# EAGLE schematic TP-34ren (EAGLE 6.6.0)

## Sheet 1 of 4
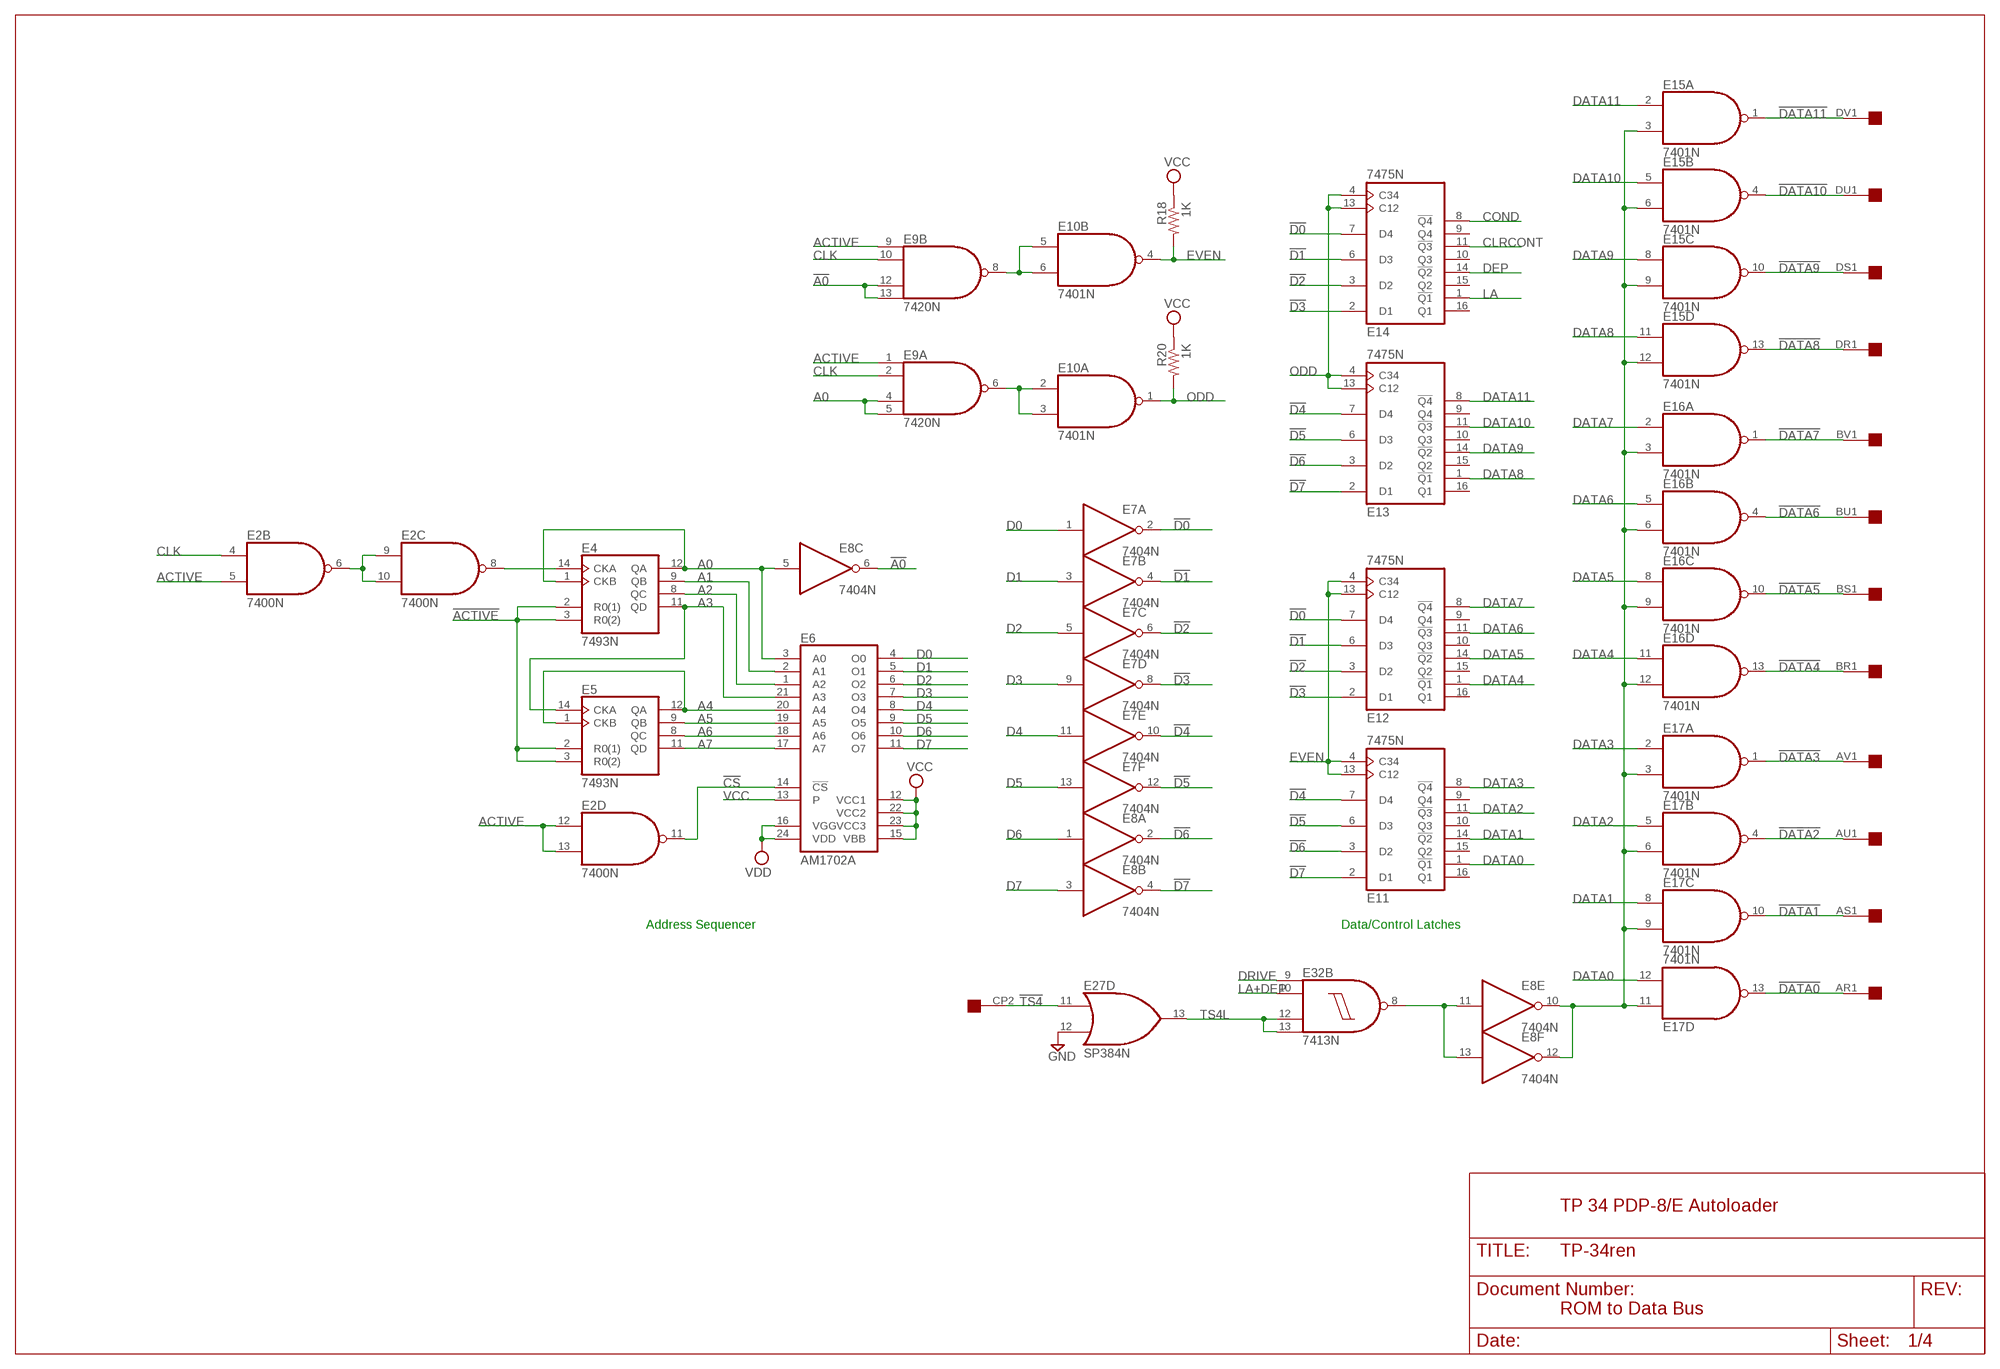
[diagram p0: schematic, sheet 1]

### Parts
E2  7400N  [DIL14]
E4  7493N  74LS93N  [DIL14]
E5  7493N  74LS93N  [DIL14]
E6  AM1702A  AM1702  [DIL24]
E7  7404N  [DIL14]
E8  7404N  [DIL14]
E9  7420N  74S20N  [DIL14]
E10  7401N  74LS01N  [DIL14]
E11  7475N  [DIL16]
E12  7475N  [DIL16]
E13  7475N  [DIL16]
E14  7475N  [DIL16]
E15  7401N  74LS01N  [DIL14]
E16  7401N  74LS01N  [DIL14]
E17  7401N  74LS01N  [DIL14]
E27  SP384N  [DIL14]
E32  7413N  [DIL14]
R18  1K  R-US_0207/10  [0207/10]
R20  1K  R-US_0207/10  [0207/10]
U$2  QUAD  [EDGE-CON8]

### Nets
!A0: E8.6(C:O) E9.12(B:I2) E9.13(B:I3)
!ACTIVE: E4.2(R0(1)) E4.3(R0(2)) E5.2(R0(1)) E5.3(R0(2)) ; also sheet 2
!CS: E2.11(D:O) E6.14(!CS)
!D0: E7.2(A:O) E12.7(D4) E14.7(D4)
!D1: E7.4(B:O) E12.6(D3) E14.6(D3)
!D2: E7.6(C:O) E12.3(D2) E14.3(D2)
!D3: E7.8(D:O) E12.2(D1) E14.2(D1)
!D4: E7.10(E:O) E11.7(D4) E13.7(D4)
!D5: E7.12(F:O) E11.6(D3) E13.6(D3)
!D6: E8.2(A:O) E11.3(D2) E13.3(D2)
!D7: E8.4(B:O) E11.2(D1) E13.2(D1)
!DATA0: E17.13(D:O) U$2.AR1
!DATA1: E17.10(C:O) U$2.AS1
!DATA2: E17.4(B:O) U$2.AU1
!DATA3: E17.1(A:O) U$2.AV1
!DATA4: E16.13(D:O) U$2.BR1
!DATA5: E16.10(C:O) U$2.BS1
!DATA6: E16.4(B:O) U$2.BU1
!DATA7: E16.1(A:O) U$2.BV1
!DATA8: E15.13(D:O) U$2.DR1
!DATA9: E15.10(C:O) U$2.DS1
!DATA10: E15.4(B:O) U$2.DU1
!DATA11: E15.1(A:O) U$2.DV1
!TS4: E27.11(D:I0) U$2.CP2
A0: E4.1(CKB) E4.12(QA) E6.3(A0) E8.5(C:I) E9.4(A:I2) E9.5(A:I3)
A1: E4.9(QB) E6.2(A1)
A2: E4.8(QC) E6.1(A2)
A3: E4.11(QD) E5.14(CKA) E6.21(A3)
A4: E5.1(CKB) E5.12(QA) E6.20(A4)
A5: E5.9(QB) E6.19(A5)
A6: E5.8(QC) E6.18(A6)
A7: E5.11(QD) E6.17(A7)
ACTIVE: E2.5(B:I1) E2.12(D:I0) E2.13(D:I1) E9.1(A:I0) E9.9(B:I0) ; also sheet 2
CLK: E2.4(B:I0) E9.2(A:I1) E9.10(B:I1) ; also sheet 2
CLRCONT: E14.11(!Q3) ; also sheet 2
COND: E14.8(!Q4) ; also sheet 2
D0: E6.4(O0) E7.1(A:I)
D1: E6.5(O1) E7.3(B:I)
D2: E6.6(O2) E7.5(C:I)
D3: E6.7(O3) E7.9(D:I)
D4: E6.8(O4) E7.11(E:I)
D5: E6.9(O5) E7.13(F:I)
D6: E6.10(O6) E8.1(A:I)
D7: E6.11(O7) E8.3(B:I)
DATA0: E11.1(!Q1) E17.12(D:I1)
DATA1: E11.14(!Q2) E17.8(C:I0)
DATA2: E11.11(!Q3) E17.5(B:I0)
DATA3: E11.8(!Q4) E17.2(A:I0)
DATA4: E12.1(!Q1) E16.11(D:I0)
DATA5: E12.14(!Q2) E16.8(C:I0)
DATA6: E12.11(!Q3) E16.5(B:I0)
DATA7: E12.8(!Q4) E16.2(A:I0)
DATA8: E13.1(!Q1) E15.11(D:I0)
DATA9: E13.14(!Q2) E15.8(C:I0)
DATA10: E13.11(!Q3) E15.5(B:I0)
DATA11: E13.8(!Q4) E15.2(A:I0)
DEP: E14.14(!Q2) ; also sheet 2
DRIVE: E32.9(B:I0) ; also sheet 3
EVEN: E10.4(B:O) E11.4(C34) E11.13(C12) E12.4(C34) E12.13(C12) R18.2
GND [supply]: E27.12(D:I1) ; also sheet 2,3
LA: E14.1(!Q1) ; also sheet 2
LA+DEP: E32.10(B:I1) ; also sheet 3
N$7: E9.6(A:O) E10.2(A:I0) E10.3(A:I1)
N$9: E9.8(B:O) E10.5(B:I0) E10.6(B:I1)
N$20: E8.10(E:O) E8.12(F:O) E15.3(A:I1) E15.6(B:I1) E15.9(C:I1) E15.12(D:I1) E16.3(A:I1) E16.6(B:I1) E16.9(C:I1) E16.12(D:I1) E17.3(A:I1) E17.6(B:I1) E17.9(C:I1) E17.11(D:I0)
N$99: E8.11(E:I) E8.13(F:I) E32.8(B:O)
N$163: E2.6(B:O) E2.9(C:I0) E2.10(C:I1)
N$167: E2.8(C:O) E4.14(CKA)
ODD: E10.1(A:O) E13.4(C34) E13.13(C12) E14.4(C34) E14.13(C12) R20.2 ; also sheet 2
TS4L: E27.13(D:O) E32.12(B:I2) E32.13(B:I3)
VCC [supply]: E6.12(VCC1) E6.13(P) E6.15(VBB) E6.22(VCC2) E6.23(VCC3) R18.1 R20.1 ; also sheet 2,3
VDD: E6.16(VGG) E6.24(VDD) ; also sheet 2
Unconnected: E11.9(Q4) E11.10(Q3) E11.15(Q2) E11.16(Q1) E12.9(Q4) E12.10(Q3) E12.15(Q2) E12.16(Q1) E13.9(Q4) E13.10(Q3) E13.15(Q2) E13.16(Q1) E14.9(Q4) E14.10(Q3) E14.15(Q2) E14.16(Q1) E27.9(C:I0) E27.10(C:I1) E27.14(C:O) U$2.AA1 U$2.AB1 U$2.AC1 U$2.AD1 U$2.AD2 U$2.AE1 U$2.AE2 U$2.AH1 U$2.AH2 U$2.AJ1 U$2.AK1 U$2.AL1 U$2.AL2 U$2.AM1 U$2.AM2 U$2.AN2 U$2.AP1 U$2.AP2 U$2.AR2 U$2.AS2 U$2.AT1 U$2.AT2 U$2.AU2 U$2.AV2 U$2.BA1 U$2.BB1 U$2.BB2 U$2.BC1 U$2.BD1 U$2.BD2 U$2.BE1 U$2.BE2 U$2.BH1 U$2.BH2 U$2.BJ1 U$2.BJ2 U$2.BK1 U$2.BL1 U$2.BL2 U$2.BM1 U$2.BN2 U$2.BP1 U$2.BP2 U$2.BR2 U$2.BS2 U$2.BT1 U$2.BT2 U$2.BV2 U$2.CA1 U$2.CB1 U$2.CB2 U$2.CC1 U$2.CD1 U$2.CD2 U$2.CE1 U$2.CE2 U$2.CF1 U$2.CH1 U$2.CH2 U$2.CJ1 U$2.CK1 U$2.CK2 U$2.CL1 U$2.CL2 U$2.CM1 U$2.CM2 U$2.CN1 U$2.CN2 U$2.CP1 U$2.CR2 U$2.CS1 U$2.CS2 U$2.CT1 U$2.CU1 U$2.CU2 U$2.CV2 U$2.DA1 U$2.DA2 U$2.DB1 U$2.DC1 U$2.DC2 U$2.DD1 U$2.DD2 U$2.DE1 U$2.DE2 U$2.DH1 U$2.DH2 U$2.DJ1 U$2.DJ2 U$2.DK1 U$2.DK2 U$2.DL1 U$2.DL2 U$2.DM1 U$2.DM2 U$2.DP1 U$2.DP2 U$2.DT1 U$2.DT2

### Notes on the sheet
- Address Sequencer | Data/Control Latches
- TP 34 PDP-8/E Autoloader
- ROM to Data Bus

## Sheet 2 of 4
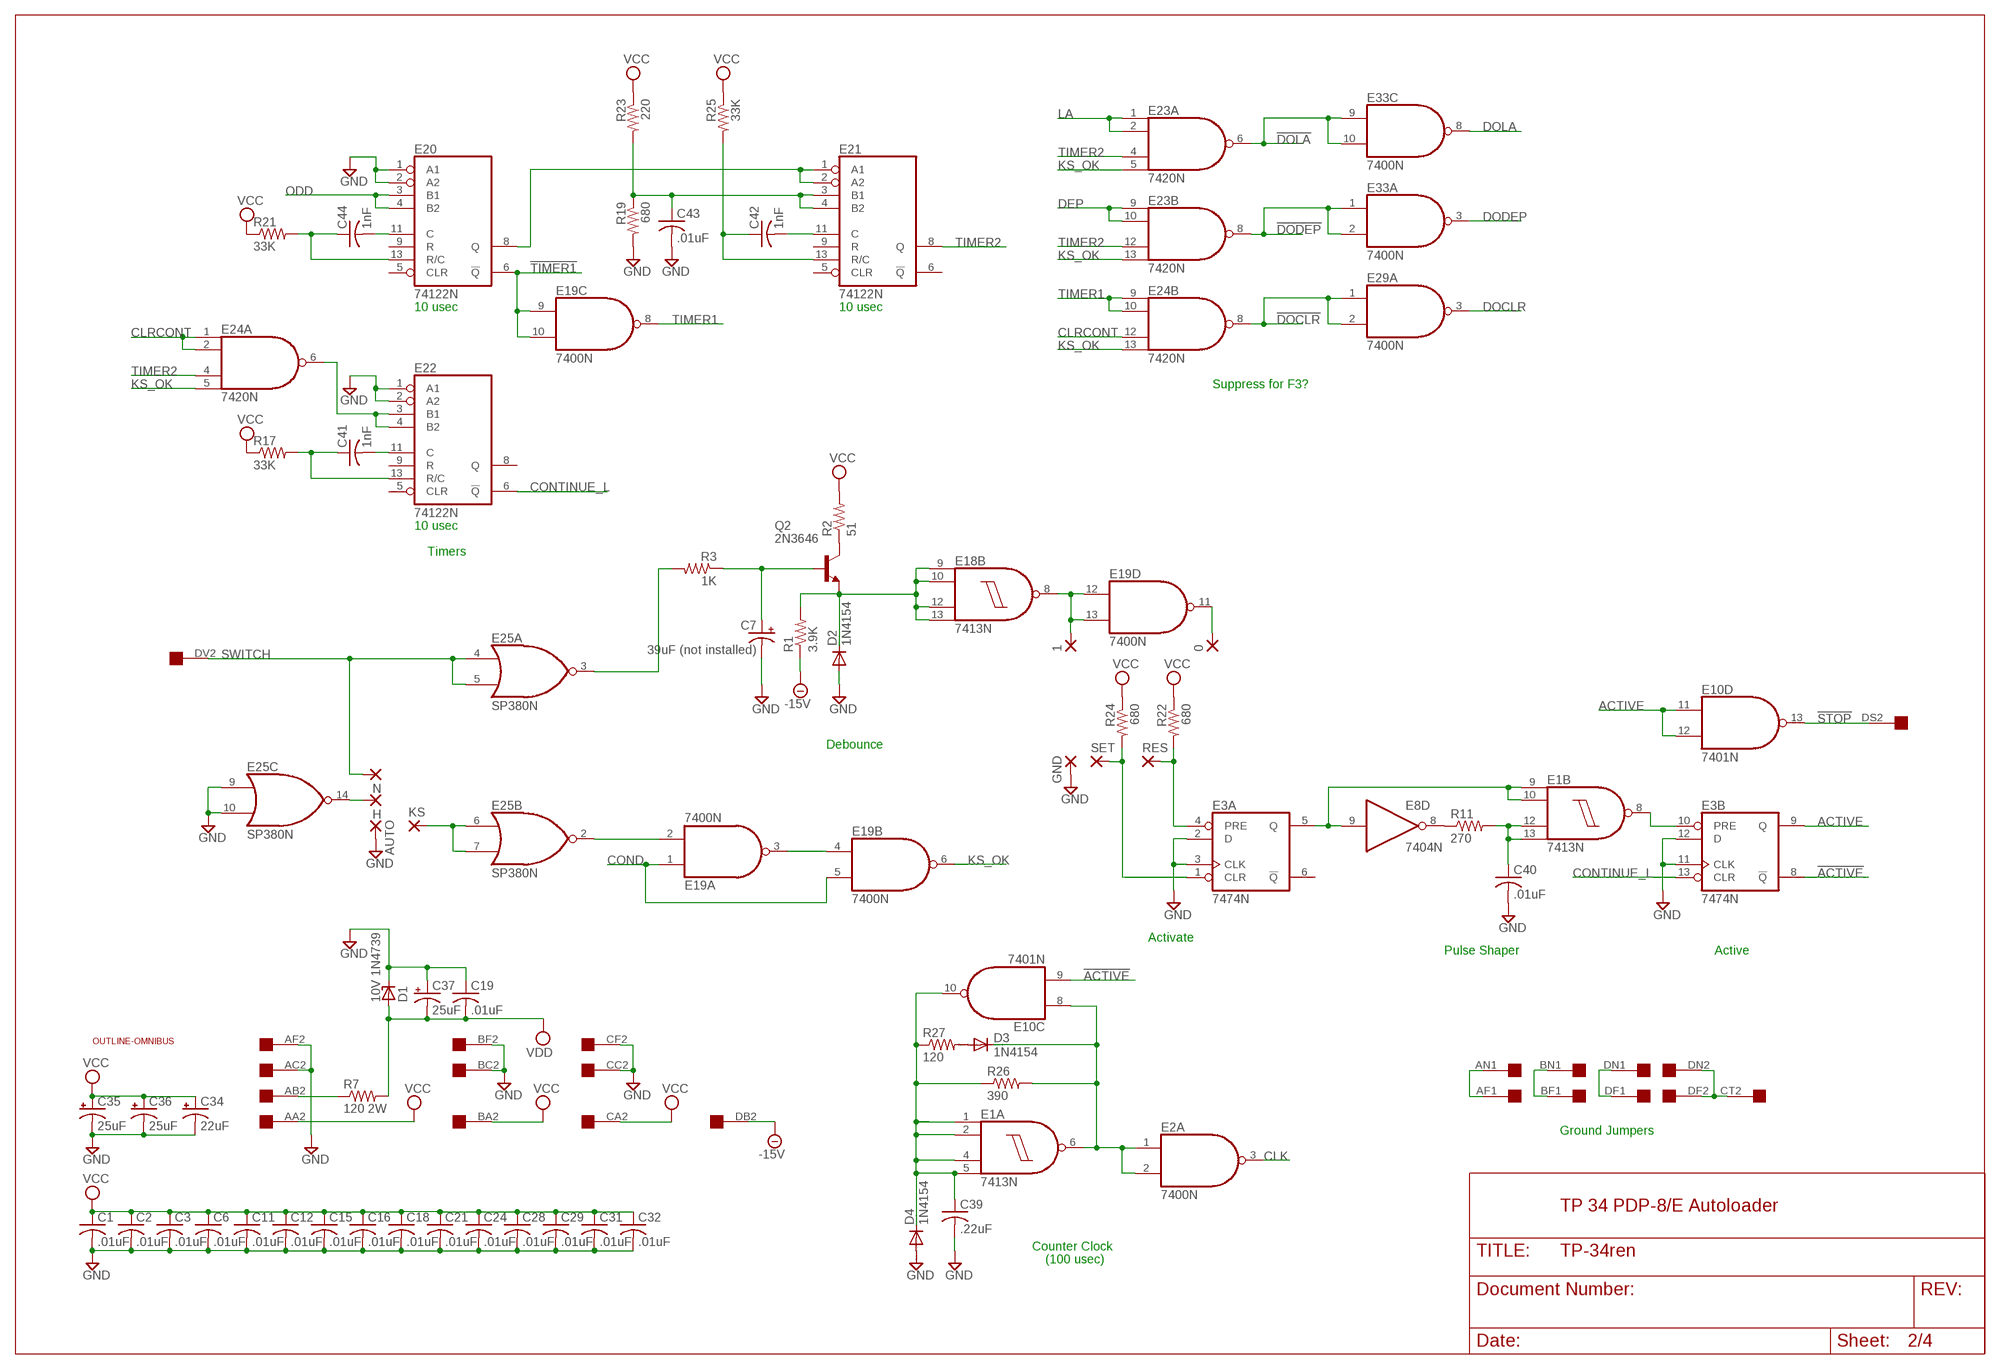
[diagram p1: schematic, sheet 2]

### Parts
0  1,6/0,8  [1,6/0,8]
1  1,6/0,8  [1,6/0,8]
AUTO  1,6/0,8  [1,6/0,8]
C1  .01uF  C-US075-032X103  [C075-032X103]
C2  .01uF  C-US075-032X103  [C075-032X103]
C3  .01uF  C-US075-032X103  [C075-032X103]
C6  .01uF  C-US075-032X103  [C075-032X103]
C7  39uF (not installed)  CPOL-USE15-5AXIAL  [E15-5]
C11  .01uF  C-US075-032X103  [C075-032X103]
C12  .01uF  C-US075-032X103  [C075-032X103]
C15  .01uF  C-US075-032X103  [C075-032X103]
C16  .01uF  C-US075-032X103  [C075-032X103]
C18  .01uF  C-US075-032X103  [C075-032X103]
C19  .01uF  C-US075-032X103  [C075-032X103]
C21  .01uF  C-US075-032X103  [C075-032X103]
C24  .01uF  C-US075-032X103  [C075-032X103]
C28  .01uF  C-US075-032X103  [C075-032X103]
C29  .01uF  C-US075-032X103  [C075-032X103]
C31  .01uF  C-US075-032X103  [C075-032X103]
C32  .01uF  C-US075-032X103  [C075-032X103]
C34  22uF  CPOL-USE20-8AXIAL  [E12-8]
C35  25uF  CPOL-USE15-5AXIAL  [E15-5]
C36  25uF  CPOL-USE15-5AXIAL  [E15-5]
C37  25uF  CPOL-USE15-5AXIAL  [E15-5]
C39  .22uF  C-US075-032X103  [C075-032X103]
C40  .01uF  C-US075-032X103  [C075-032X103]
C41  1nF  C-US075-032X103  [C075-032X103]
C42  1nF  C-US075-032X103  [C075-032X103]
C43  .01uF  C-US075-032X103  [C075-032X103]
C44  1nF  C-US075-032X103  [C075-032X103]
D1  10V 1N4739  ZENER-DIODEC1702-15  [C1702-15]
D2  1N4154  1N4148DO35-10  [DO35-10]
D3  1N4154  1N4148DO35-10  [DO35-10]
D4  1N4154  1N4148DO35-10  [DO35-10]
E1  7413N  [DIL14]
E3  7474N  74S74N  [DIL14]
E18  7413N  [DIL14]
E19  7400N  [DIL14]
E20  74122N  74LS122N  [DIL14]
E21  74122N  74LS122N  [DIL14]
E22  74122N  74LS122N  [DIL14]
E23  7420N  74S20N  [DIL14]
E24  7420N  74S20N  [DIL14]
E25  SP380N  [DIL14]
E29  7400N  [DIL14]
E33  7400N  [DIL14]
GND  1,6/0,8  [1,6/0,8]
H  1,6/0,8  [1,6/0,8]
KS  1,6/0,8  [1,6/0,8]
N  1,6/0,8  [1,6/0,8]
Q2  2N3646  2N2102  [TO5]
R1  3.9K  R-US_0207/10  [0207/10]
R2  51  R-US_0207/10  [0207/10]
R3  1K  R-US_0207/10  [0207/10]
R7  120 2W  R-US_0414/15  [0414/15]
R11  270  R-US_0207/12  [0207/12]
R17  33K  R-US_0207/10  [0207/10]
R19  680  R-US_0207/10  [0207/10]
R21  33K  R-US_0207/10  [0207/10]
R22  680  R-US_0207/10  [0207/10]
R23  220  R-US_0207/10  [0207/10]
R24  680  R-US_0207/10  [0207/10]
R25  33K  R-US_0207/10  [0207/10]
R26  390  R-US_0207/10  [0207/10]
R27  120  R-US_0207/10  [0207/10]
RES  1,6/0,8  [1,6/0,8]
SET  1,6/0,8  [1,6/0,8]
U$1  OUTLINE-OMNIBUS  [OMNIBUS]

### Nets
!ACTIVE: E3.8(B:!Q) E10.9(C:I1) ; also sheet 1
!DOCLR: E24.8(B:O) E29.1(A:I0) E29.2(A:I1) ; also sheet 3
!DODEP: E23.8(B:O) E33.1(A:I0) E33.2(A:I1) ; also sheet 3
!DOLA: E23.6(A:O) E33.9(C:I0) E33.10(C:I1) ; also sheet 3
!STOP: E10.13(D:O) U$2.DS2
!TIMER1: E19.9(C:I0) E19.10(C:I1) E20.6(!Q)
-15V: R1.1 U$2.DB2
ACTIVE: E3.9(B:Q) E10.11(D:I0) E10.12(D:I1) ; also sheet 1
CLK: E2.3(A:O) ; also sheet 1
CLRCONT: E24.1(A:I0) E24.2(A:I1) E24.12(B:I2) ; also sheet 1
COND: E19.1(A:I0) E19.5(B:I1) ; also sheet 1
CONTINUE_L: E3.13(B:CLR) E22.6(!Q) ; also sheet 3
DEP: E23.9(B:I0) E23.10(B:I1) ; also sheet 1
DOCLR: E29.3(A:O) ; also sheet 3
DODEP: E33.3(A:O) ; also sheet 3
DOLA: E33.8(C:O) ; also sheet 3
GND [supply]: AUTO.1(P) C1.2 C2.2 C3.2 C6.2 C7.- C11.2 C12.2 C15.2 C16.2 C18.2 C19.1 C21.2 C24.2 C28.2 C29.2 C31.2 C32.2 C34.- C35.- C36.- C37.+ C39.2 C40.2 C43.2 D1.C D2.A D4.A E3.2(A:D) E3.3(A:CLK) E3.11(B:CLK) E3.12(B:D) E20.1(A1) E20.2(A2) E22.1(A1) E22.2(A2) E25.9(C:I0) E25.10(C:I1) GND.1(P) R19.2 U$2.AC2 U$2.AF2 U$2.BC2 U$2.BF2 U$2.CC2 U$2.CF2 ; also sheet 1,3
KS_OK: E19.6(B:O) E23.5(A:I3) E23.13(B:I3) E24.5(A:I3) E24.13(B:I3)
LA: E23.1(A:I0) E23.2(A:I1) ; also sheet 1
N$1 [supply]: U$2.AF1 U$2.AN1
N$2 [supply]: U$2.BF1 U$2.BN1
N$3 [supply]: U$2.DF1 U$2.DN1
N$4 [supply]: U$2.CT2 U$2.DF2 U$2.DN2
N$6: D2.C E18.9(B:I0) E18.10(B:I1) E18.12(B:I2) E18.13(B:I3) Q2.1(E) R1.2
N$11: D3.C E1.6(A:O) E2.1(A:I0) E2.2(A:I1) E10.8(C:I0) R26.2
N$17: D3.A R27.2
N$21: C39.1 D4.C E1.1(A:I0) E1.2(A:I1) E1.4(A:I2) E1.5(A:I3) E10.10(C:O) R26.1 R27.1
N$26: E1.9(B:I0) E1.10(B:I1) E3.5(A:Q) E8.9(D:I)
N$44: 1.1(P) E18.8(B:O) E19.12(D:I0) E19.13(D:I1)
N$49: E3.4(A:PRE) R22.2 RES.1(P)
N$50: E3.1(A:CLR) R24.2 SET.1(P)
N$57: 0.1(P) E19.11(D:O)
N$64: C42.1 E21.13(R/C) R25.2
N$65: C42.2 E21.11(C)
N$67: C43.1 E21.3(B1) E21.4(B2) R19.1 R23.2
N$74: C44.1 E20.13(R/C) R21.2
N$75: C40.1 E1.12(B:I2) E1.13(B:I3) R11.2
N$84: E1.8(B:O) E3.10(B:PRE)
N$85: C44.2 E20.11(C)
N$107: E8.8(D:O) R11.1
N$159: C7.+ Q2.2(B) R3.1
N$173: Q2.3(C) R2.1
N$223: C41.1 E22.13(R/C) R17.2
N$234: C41.2 E22.11(C)
N$240 [supply]: R7.1 U$2.AB2
N$300: E19.3(A:O) E19.4(B:I0)
N$302: E19.2(A:I1) E25.2(B:O)
N$315: E22.3(B1) E22.4(B2) E24.6(A:O)
N$325: E25.6(B:I0) E25.7(B:I1) KS.1(P)
N$331: E25.14(C:O) H.1(P)
N$344: E20.8(Q) E21.1(A1) E21.2(A2)
ODD: E20.3(B1) E20.4(B2) ; also sheet 1
SWITCH: E25.4(A:I0) E25.5(A:I1) N.1(P) U$2.DV2
SWITCHL: E25.3(A:O) R3.2
TIMER1: E19.8(C:O) E24.9(B:I0) E24.10(B:I1)
TIMER2: E21.8(Q) E23.4(A:I2) E23.12(B:I2) E24.4(A:I2)
VCC [supply]: C1.1 C2.1 C3.1 C6.1 C11.1 C12.1 C15.1 C16.1 C18.1 C21.1 C24.1 C28.1 C29.1 C31.1 C32.1 C34.+ C35.+ C36.+ R2.2 R17.1 R21.1 R22.1 R23.1 R24.1 R25.1 U$2.AA2 U$2.BA2 U$2.CA2 ; also sheet 1,3
VDD: C19.2 C37.- D1.A R7.2 ; also sheet 1
Unconnected: E3.6(A:!Q) E20.5(CLR) E20.9(R) E21.5(CLR) E21.6(!Q) E21.9(R) E22.5(CLR) E22.8(Q) E22.9(R) E25.11(D:I0) E25.12(D:I1) E25.13(D:O) E33.11(D:O) E33.12(D:I0) E33.13(D:I1)

### Notes on the sheet
- 10 usec | 10 usec
- Suppress for F3?
- 10 usec
- Timers
- Debounce
- Activate
- Pulse Shaper | Active
- Ground Jumpers
- TP 34 PDP-8/E Autoloader
- Counter Clock
- (100 usec)

## Sheet 3 of 4
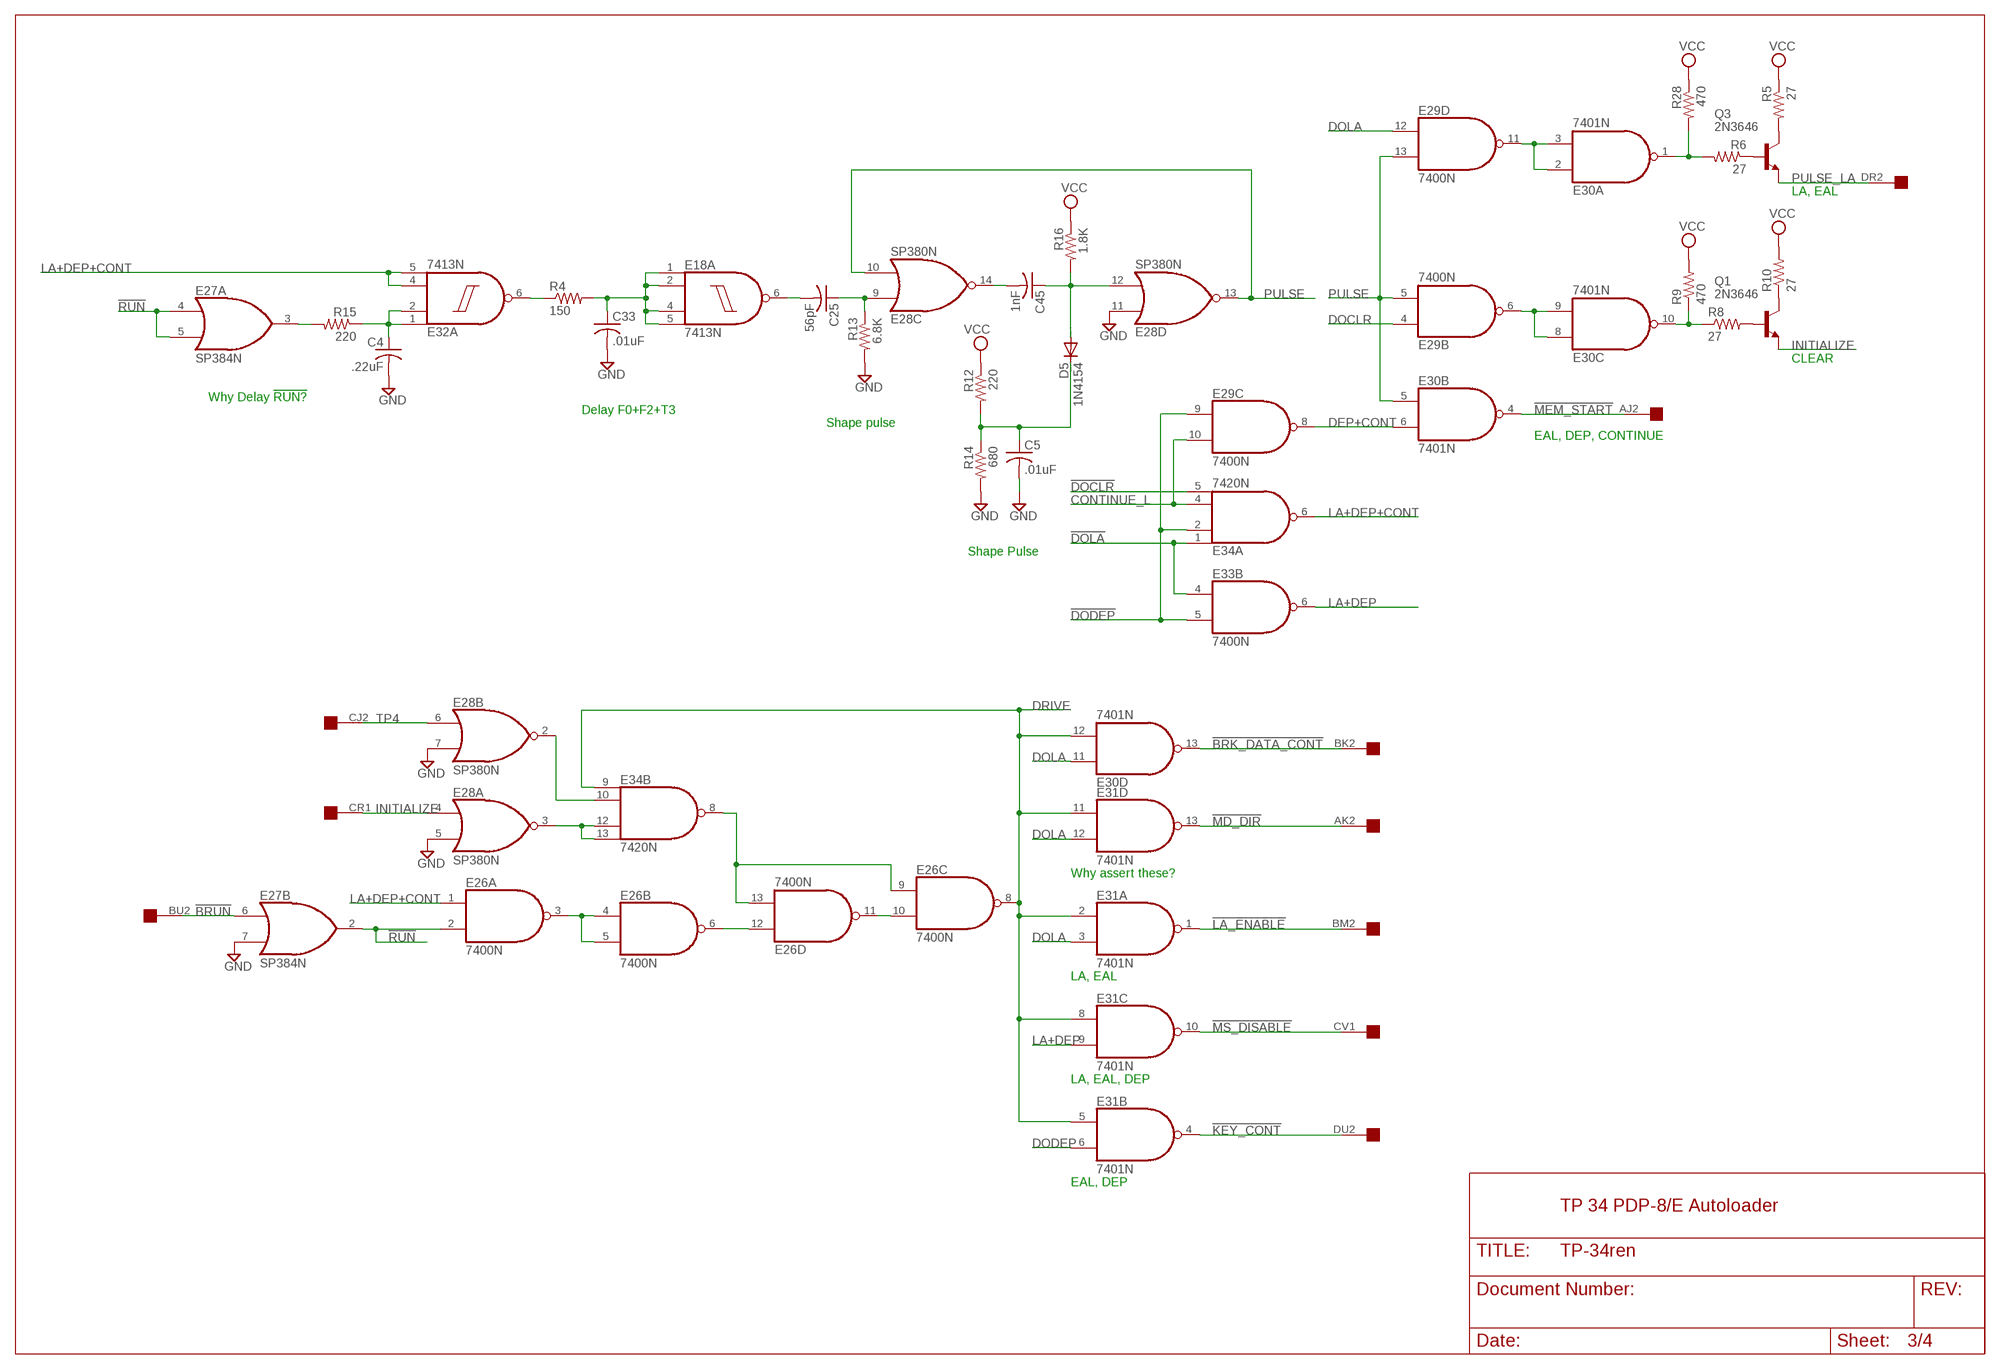
[diagram p2: schematic, sheet 3]

### Parts
C4  .22uF  C-US075-032X103  [C075-032X103]
C5  .01uF  C-US075-032X103  [C075-032X103]
C25  56pF  C-US102-043X133  [C102-043X133]
C33  .01uF  C-US075-032X103  [C075-032X103]
C45  1nF  C-US050-035X075  [C050-035X075]
D5  1N4154  1N4148DO35-10  [DO35-10]
E26  7400N  [DIL14]
E28  SP380N  [DIL14]
E30  7401N  74LS01N  [DIL14]
E31  7401N  74LS01N  [DIL14]
E34  7420N  74S20N  [DIL14]
Q1  2N3646  2N2102  [TO5]
Q3  2N3646  2N2102  [TO5]
R4  150  R-US_0207/10  [0207/10]
R5  27  R-US_0207/10  [0207/10]
R6  27  R-US_0207/10  [0207/10]
R8  27  R-US_0207/10  [0207/10]
R9  470  R-US_0207/10  [0207/10]
R10  27  R-US_0207/10  [0207/10]
R12  220  R-US_0207/10  [0207/10]
R13  6.8K  R-US_0207/10  [0207/10]
R14  680  R-US_0207/10  [0207/10]
R15  220  R-US_0207/15  [0207/15]
R16  1.8K  R-US_0207/10  [0207/10]
R28  470  R-US_0207/10  [0207/10]

### Nets
!BRK_DATA_CONT: E30.13(D:O) U$2.BK2
!BRUN: E27.6(B:I0) U$2.BU2
!DOCLR: E34.5(A:I3) ; also sheet 2
!DODEP: E29.9(C:I0) E33.5(B:I1) E34.2(A:I1) ; also sheet 2
!DOLA: E33.4(B:I0) E34.1(A:I0) ; also sheet 2
!INITIALIZE: E28.3(A:O) E34.12(B:I2) E34.13(B:I3)
!KEY_CONT: E31.4(B:O) U$2.DU2
!LA_ENABLE: E31.1(A:O) U$2.BM2
!MD_DIR: E31.13(D:O) U$2.AK2
!MEM_START: E30.4(B:O) U$2.AJ2
!MS_DISABLE: E31.10(C:O) U$2.CV1
!RUN: E26.2(A:I1) E27.2(B:O) E27.4(A:I0) E27.5(A:I1)
!TP4: E28.2(B:O) E34.10(B:I1)
BRUNL: E27.3(A:O) R15.2
CONTINUE_L: E29.10(C:I1) E34.4(A:I2) ; also sheet 2
DEP+CONT: E29.8(C:O) E30.6(B:I1)
DOCLR: E29.4(B:I0) ; also sheet 2
DODEP: E31.6(B:I1) ; also sheet 2
DOLA: E29.12(D:I0) E30.11(D:I0) E31.3(A:I1) E31.12(D:I1) ; also sheet 2
DRIVE: E26.8(C:O) E30.12(D:I1) E31.2(A:I0) E31.5(B:I0) E31.8(C:I0) E31.11(D:I0) E34.9(B:I0) ; also sheet 1
GND [supply]: C4.2 C5.2 C33.2 E27.7(B:I1) E28.5(A:I1) E28.7(B:I1) E28.11(D:I0) R13.2 R14.2 ; also sheet 1,2
INITIALIZE: E28.4(A:I0) Q1.1(E) U$2.CR1
LA+DEP: E31.9(C:I1) E33.6(B:O) ; also sheet 1
LA+DEP+CONT: E26.1(A:I0) E32.4(A:I2) E32.5(A:I3) E34.6(A:O)
N$5: E26.6(B:O) E26.12(D:I0)
N$14: C25.2 E18.6(A:O)
N$22: C25.1 E28.9(C:I0) R13.1
N$23: C45.1 D5.A E28.12(D:I1) R16.2
N$24: C5.1 D5.C R12.2 R14.1
N$28: C45.2 E28.14(C:O)
N$38: E26.9(C:I0) E26.13(D:I1) E34.8(B:O)
N$94: E29.11(D:O) E30.2(A:I0) E30.3(A:I1)
N$96: E29.6(B:O) E30.8(C:I0) E30.9(C:I1)
N$110: E26.3(A:O) E26.4(B:I0) E26.5(B:I1)
N$116: E26.10(C:I1) E26.11(D:O)
N$134: E30.1(A:O) R6.2 R28.2
N$143: E30.10(C:O) R8.1 R9.1
N$169: Q1.3(C) R10.1
N$171: Q1.2(B) R8.2
N$205: C4.1 E32.1(A:I0) E32.2(A:I1) R15.1
N$222: E32.6(A:O) R4.1
N$231: C33.1 E18.1(A:I0) E18.2(A:I1) E18.4(A:I2) E18.5(A:I3) R4.2
N$237: Q3.3(C) R5.2
N$238: Q3.2(B) R6.1
PULSE: E28.10(C:I1) E28.13(D:O) E29.5(B:I1) E29.13(D:I1) E30.5(B:I0)
PULSE_LA: Q3.1(E) U$2.DR2
TP4: E28.6(B:I0) U$2.CJ2
VCC [supply]: R5.1 R9.2 R10.2 R12.1 R16.1 R28.1 ; also sheet 1,2

### Notes on the sheet
- LA, EAL
- CLEAR
- Why Delay !RUN?
- Delay F0+F2+T3
- Shape pulse
- EAL, DEP, CONTINUE
- Shape Pulse
- Why assert these?
- LA, EAL
- LA, EAL, DEP
- EAL, DEP
- TP 34 PDP-8/E Autoloader

## Sheet 4 of 4
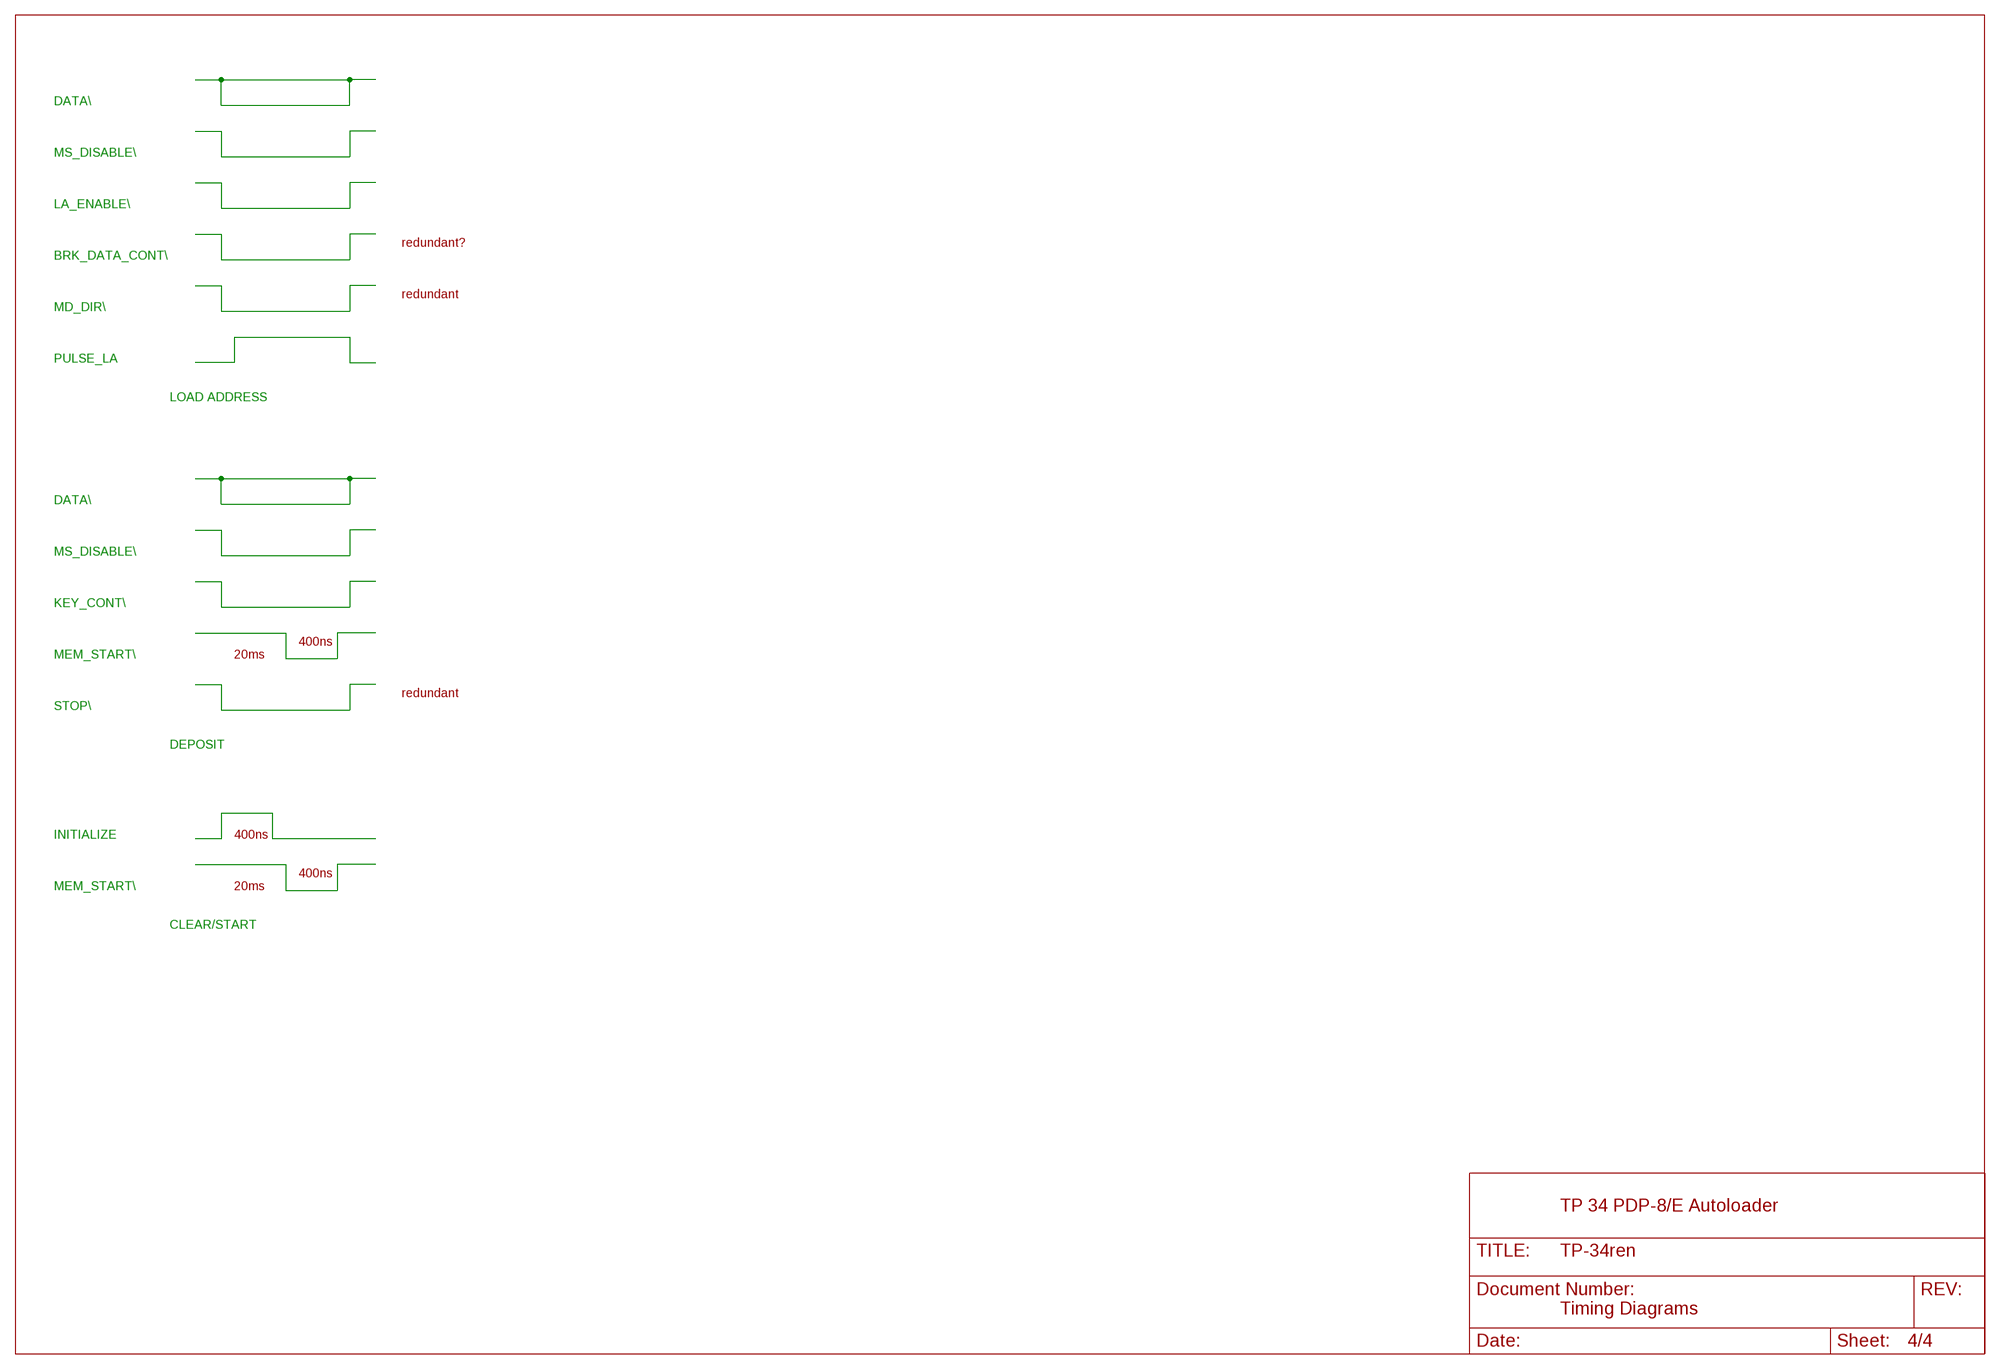
[diagram p3: schematic, sheet 4]

### Notes on the sheet
- DATA\\
- MS_DISABLE\\
- LA_ENABLE\\
- redundant?
- BRK_DATA_CONT\\
- redundant
- MD_DIR\\
- PULSE_LA
- LOAD ADDRESS
- DATA\\
- MS_DISABLE\\
- KEY_CONT\\
- 400ns
- MEM_START\\ | 20ms
- redundant
- STOP\\
- DEPOSIT
- INITIALIZE | 400ns
- 400ns
- MEM_START\\ | 20ms
- CLEAR/START
- TP 34 PDP-8/E Autoloader
- Timing Diagrams

## Power pins joined to a net without a drawn wire
GND: E1.7(P:GND) E2.7(P:GND) E3.7(P:GND) E4.10(GND) E5.10(GND) E7.7(P:GND) E8.7(P:GND) E9.7(P:GND) E10.7(P:GND) E11.12(GND) E12.12(GND) E13.12(GND) E14.12(GND) E15.7(P:GND) E16.7(P:GND) E17.7(P:GND) E18.7(P:GND) E19.7(P:GND) E20.7(GND) E21.7(GND) E22.7(GND) E23.7(P:GND) E24.7(P:GND) E25.1(P:GND) E26.7(P:GND) E27.1(GND) E28.1(P:GND) E29.7(P:GND) E30.7(P:GND) E31.7(P:GND) E32.7(P:GND) E33.7(P:GND) E34.7(P:GND)
VCC: E1.14(P:VCC) E2.14(P:VCC) E3.14(P:VCC) E4.5(VCC) E5.5(VCC) E7.14(P:VCC) E8.14(P:VCC) E9.14(P:VCC) E10.14(P:VCC) E11.5(VCC) E12.5(VCC) E13.5(VCC) E14.5(VCC) E15.14(P:VCC) E16.14(P:VCC) E17.14(P:VCC) E18.14(P:VCC) E19.14(P:VCC) E20.14(VCC) E21.14(VCC) E22.14(VCC) E23.14(P:VCC) E24.14(P:VCC) E25.8(P:VCC) E26.14(P:VCC) E27.8(VCC) E28.8(P:VCC) E29.14(P:VCC) E30.14(P:VCC) E31.14(P:VCC) E32.14(P:VCC) E33.14(P:VCC) E34.14(P:VCC)

## Library data of the parts
0 1 AUTO GND H KS N RES SET = wirepad:1,6/0,8: THROUGH-HOLE PAD
C1-C6 C11 C12 C15 C16 C18 C19 C21 C24 C25 C28 C29 C31-C33 C39-C45 = rcl:C-US: CAPACITOR, American symbol
C7 C35-C37 = rcl:CPOL-US: POLARIZED CAPACITOR, American symbol
C34 = dec-con:CPOL-USE20-8AXIAL: A 0.8 inch electrolytic.
D1 = diode:ZENER-DIODE: Z-Diode
D2-D5 = diode:1N4148: DIODE high speed (Philips)
E1 E18 E32 = 74xx-us:74*13: Dual 4-input NAND schmitt trigger
E2 E19 E26 E29 E33 = 74xx-us:74*00: Quad 2-input NAND gate
E3 = 74xx-us:74*74: Dual D type positive edge triggered FLIP FLOP, preset and clear
E4 E5 = 74xx-us:74*93: Decade, divide by twelve and binary COUNTER
E6 = dec-con:AM1702: 256x8 EPROM
E7 E8 = 74xx-us:74*04: Hex INVERTER
E9 E23 E24 E34 = 74xx-us:74*20: Dual 4-input NAND gate
E10 E15-E17 E30 E31 = 74xx-us:74*01: Quad 2-input NAND gate, open collector
E11-E14 = 74xx-us:74*75: 4-bit bistable LATCH
E20-E22 = 74xx-us:74*122: Retriggerable monostable MULTIVIBRATOR
E25 E28 = dec-con:SP380: Quad NOR gate (use 8640)
E27 = dec-con:SP384: Quad OR gate
Q1-Q3 = transistor-npn:2N2102: NPN Transistor
R1-R28 = rcl:R-US_: RESISTOR, American symbol
U$1 = dec-con:OUTLINE-*: Board outlines for DEC boards.
U$2 = dec-con:QUAD: Quad-Height DEC board

## Net classes
1 supply: width 0.813 mm